# EAGLE design ovtave up SMD pcbv1 (EAGLE 9.5.2)
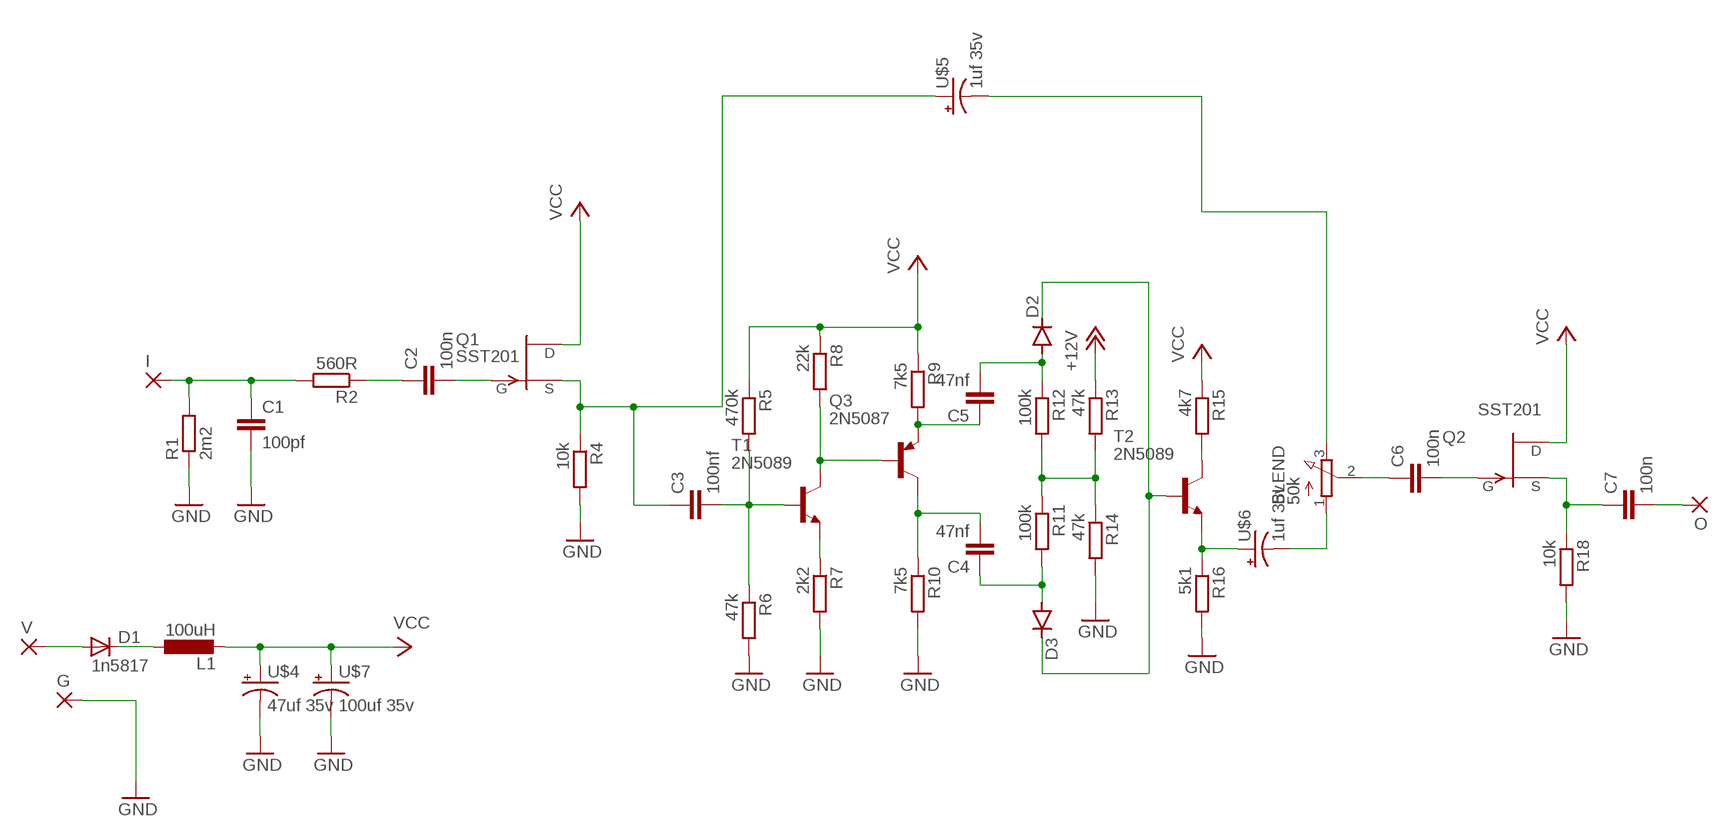
[diagram p0: schematic, sheet 1]

## Parts
BLEND  50k  HEXPOT1  [3RP/1610N]
C1  100pf  C-EUC0805K  [C0805K]
C2  100n  C-EUC0805K  [C0805K]
C3  100nf  C-EUC0805K  [C0805K]
C4  47nf  C-EUC0805K  [C0805K]
C5  47nf  C-EUC0805K  [C0805K]
C6  100n  C-EUC0805K  [C0805K]
C7  100n  C-EUC0805K  [C0805K]
D1  1n5817  SMALL_DIODEDO35-7  [DO35-7]
D2  AA112  [DO07]
D3  AA112  [DO07]
G  1,6/0,9  [1,6/0,9]
I  1,6/0,9  [1,6/0,9]
L1  100uH  L-EUL2012C  [L2012C]
O  1,6/0,9  [1,6/0,9]
Q1  SST201  [SOT23]
Q2  SST201  [SOT23]
Q3  2N5087  [TO92]
R1  2m2  R-EU_M0805  [M0805]
R2  560R  R-EU_M0805  [M0805]
R4  10k  R-EU_M0805  [M0805]
R5  470k  R-EU_M0805  [M0805]
R6  47k  R-EU_M0805  [M0805]
R7  2k2  R-EU_M0805  [M0805]
R8  22k  R-EU_M0805  [M0805]
R9  7k5  R-EU_M0805  [M0805]
R10  7k5  R-EU_M0805  [M0805]
R11  100k  R-EU_M0805  [M0805]
R12  100k  R-EU_M0805  [M0805]
R13  47k  R-EU_M0805  [M0805]
R14  47k  R-EU_M0805  [M0805]
R15  4k7  R-EU_M0805  [M0805]
R16  5k1  R-EU_M0805  [M0805]
R18  10k  R-EU_M0805  [M0805]
T1  2N5089  2N5088  [TO92]
T2  2N5089  2N5088  [TO92]
U$4  47uf 35v  CAP_SMD+THRUPAN_B  [PAN_B_SMD+THRU]
U$5  1uf 35v  CAP_SMD+THRUPAN_B  [PAN_B_SMD+THRU]
U$6  1uf 35v  CAP_SMD+THRUPAN_B  [PAN_B_SMD+THRU]
U$7  100uf 35v  CAP_SMD+THRUPAN_C  [PAN_C_SMD+THRU]
V  1,6/0,9  [1,6/0,9]

## Nets
+12V: R13.1
GND: C1.2 G.1(P) R1.1 R4.2 R6.2 R7.2 R10.2 R14.2 R16.2 R18.2 U$4.- U$4.--(-) U$7.- U$7.--(-)
N$1: C1.1 I.1(P) R1.2 R2.2
N$2: C2.2 Q1.3(G)
N$3: C2.1 R2.1
N$4: BLEND.3(E) U$5.- U$5.--(-)
N$5: D1.C L1.1
N$6: Q3.2(B) R8.2 T1.1(C)
N$7: C6.2 Q2.3(G)
N$8: BLEND.1(A) U$6.- U$6.--(-)
N$9: C3.2 R5.2 R6.1 T1.2(B)
N$10: R15.2 T2.1(C)
N$11: C4.2 Q3.1(C) R10.1
N$12: R7.1 T1.3(E)
N$13: R11.1 R12.2 R13.2 R14.1
N$14: C3.1 Q1.2(S) R4.1 U$5.+ U$5.++(+)
N$15: C4.1 D3.A R11.2
N$16: D1.A V.1(P)
N$17: D2.C D3.C T2.2(B)
N$18: C5.2 D2.A R12.1
N$19: R16.1 T2.3(E) U$6.+ U$6.++(+)
N$20: C7.1 Q2.2(S) R18.1
N$21: C7.2 O.1(P)
N$22: BLEND.2(S) C6.1
N$24: C5.1 Q3.3(E) R9.2
VCC: L1.2 Q1.1(D) Q2.1(D) R5.1 R8.1 R9.1 R15.1 U$4.+ U$4.++(+) U$7.+ U$7.++(+)

## Library data of the parts
BLEND = hexpedalpot:HEXPOT1: 16mm Potentiometer one level Source: http://www.alphapotentiometers.net/html/16mm_pot_2.html
C1-C7 = hexresistor:C-EU: CAPACITOR, European symbol; SPICEPREFIX: C
D1 = MusicThingModular:SMALL_DIODE: Small Signal Diode
D2 D3 = diode:AA112: DIODE germanium
G I O V = wirepad:1,6/0,9: THROUGH-HOLE PAD
L1 = hexresistor:L-EU: INDUCTOR, European symbol; SPICEPREFIX: L
Q1 Q2 = jfetDSG:?20*: TEMIC / Siliconix N-Channel JFET Source: JFET-J201_Siliconix_data.pdf
Q3 = transistor-pnp:2N5087: PNP Transistor
R1 R2 R4-R16 R18 = hexresistor:R-EU_: RESISTOR, European symbol; SPICEPREFIX: R
T1 T2 = transistor:2N5088: NPN TRANSISTOR
U$4-U$7 = MusicThingModular:CAP_SMD+THRU

## Net classes
0 default: width 0.254 mm

## Board
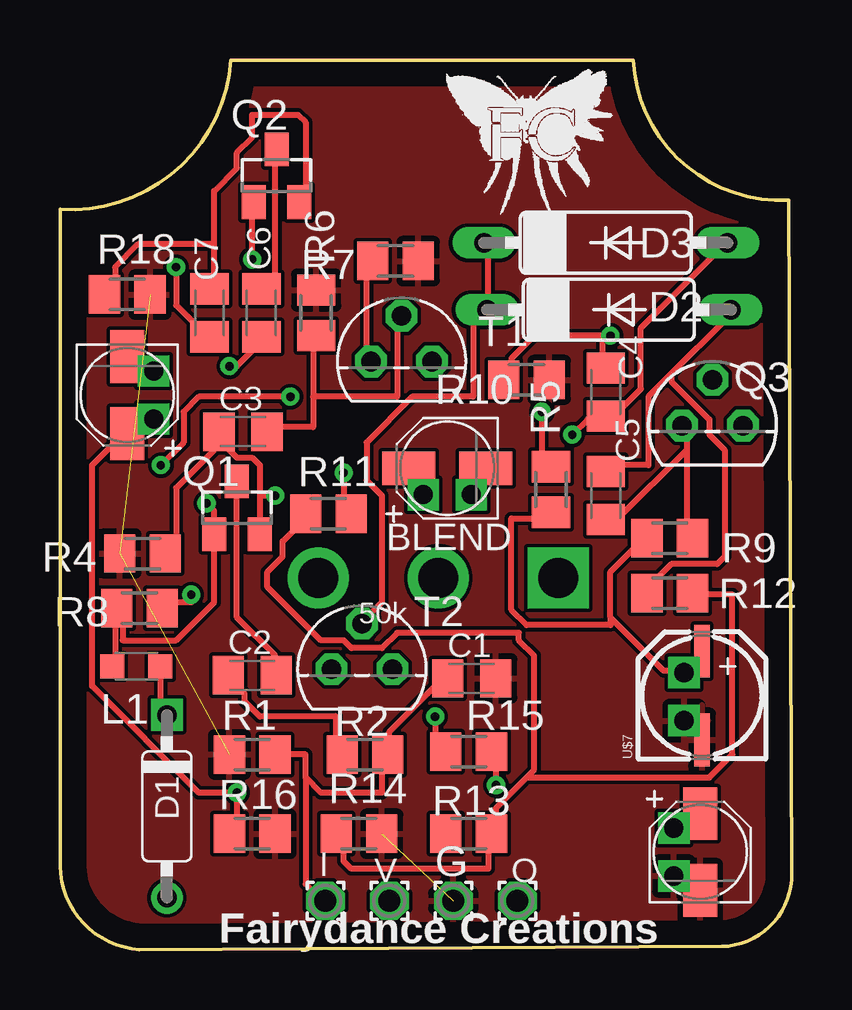
[diagram p1: board, top side]
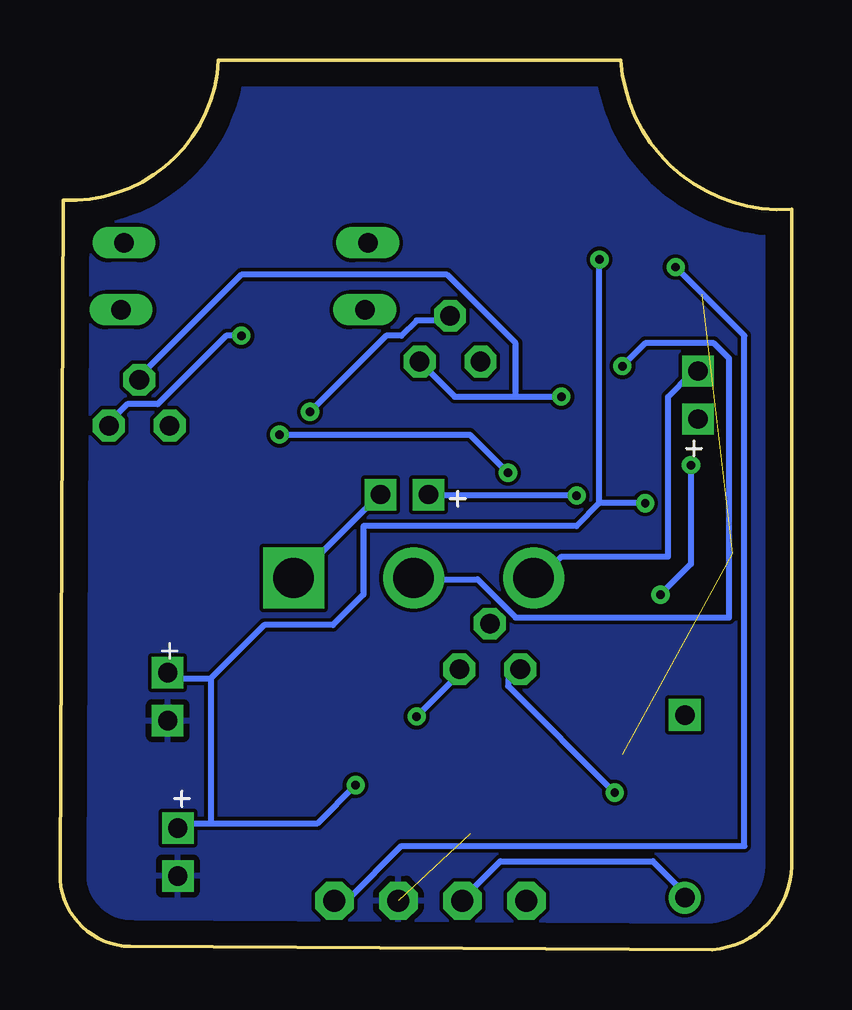
[diagram p2: board, bottom side, seen from below]

Size 30.49 x 37.08 mm. Coordinates in mm from the lower left corner, seen from the top.
Outline: 0.01,3.81 0.01,30.86 arc90 7.12,37.08 23.88,37.08 arc90 30.36,31.24 30.49,3.18 arc-90 27.57,0.13 3.31,0 arc-90 0.01,3.81
Copper layers (1*16): Top 0.035mm / dielectric 1.5mm / Bottom 0.035mm
Design rules "default": minimum track width 6mil, minimum drill 0.35mm, track to track 6mil, track to pad 6mil, pad to pad 6mil, via to via 6mil, smd to smd 6mil, copper to edge 40mil, drill to drill 6mil, minimum pad ring 10mil, minimum via ring 8mil, stop-mask expansion 4mil, vias tented up to drill 0mil, thermal gap 10mil

### Footprints (pad centres in the part's own frame; a part is rotated, then mirrored left to right if it is on the bottom)
3RP/1610N = drill 1.676 pad 2.54: 1 -5,0; 2 0,0 | drill 1.676 pad 2.54 square: 3 5,0
C0805K = smd 1.3 x 1.6: 1 -1,0; 2 1,0
DO35-7 = drill 0.813: A 3.81,0 | drill 0.813 square: C -3.81,0
DO07 = drill 0.813 long: A 5.08,0; C -5.08,0
1,6/0,9 = drill 0.914 pad 1.6 octagon: 1 0,0
L2012C = smd 1 x 1: 1 -1,0; 2 1,0
SOT23 = smd 1 x 1.4: 1 -0.95,-1.1; 2 0.95,-1.1; 3 0,1.1
TO92 = drill 0.813 octagon: 1 1.27,0; 2 0,1.905; 3 -1.27,0
M0805 = smd 1.3 x 1.6: 1 -0.95,0; 2 0.95,0
PAN_B_SMD+THRU = smd 2.2 x 1.4: + 1.6,0; - -1.6,0 | drill 0.8 pad 0.9 square: ++ 1,1.1; -- -1,1.1
PAN_C_SMD+THRU = smd 2.2 x 0.65: + 1.9,-0.2; - -1.8,-0.2 | drill 0.8 pad 0.9 square: ++ 1,0.55; -- -1,0.55

### Placement (x,y rotation side)
BLEND  15.76,15.49 0 top
C1  17.15,11.3 0 top
C2  8.01,11.43 0 top
C3  7.63,21.59 0 top
C4  22.74,23.24 90 top
C5  22.74,18.92 90 top
C6  8.39,26.54 90 top
C7  6.23,26.54 270 top
D1  4.45,5.97 270 top
D2  22.87,26.67 0 top
D3  22.74,29.46 0 top
G  16.39,2.03 0 top
I  11.06,2.03 0 top
L1  3.18,11.81 180 top
O  19.06,2.03 0 top
Q1  7.37,18.41 0 top
Q2  9.03,32.26 0 top
Q3  27.19,21.84 0 top
R1  8.01,8.13 0 top
R2  12.71,8.13 0 top
R4  3.44,16.51 180 top
R5  20.46,19.18 90 top
R6  10.68,26.54 90 top
R7  13.98,28.7 0 top
R8  3.31,14.22 0 top
R9  25.41,17.15 0 top
R10  19.44,23.75 0 top
R11  11.18,18.16 0 top
R12  25.41,14.86 0 top
R13  17.03,4.83 0 top
R14  12.45,4.83 0 top
R15  17.03,8.26 180 top
R16  8.01,4.83 0 top
R18  2.8,27.3 0 top
T1  14.23,24.51 0 top
T2  12.58,11.68 0 top
U$4  26.68,4.06 90 top
U$5  16.14,20.07 180 top
U$6  2.8,23.11 270 top
U$7  26.55,10.54 90 top
V  13.72,2.03 0 top

### Tracks (layer width: path | path; a pad name or v marks a point on that pad's centre or on a via)
GND  (3 unrouted)
  pour Bottom: -2.91,37.46 -2.91,2.16 arc90 0.14,-0.89 35.57,-0.89 35.57,37.46
  pour Top: 32.89,41.63 34.93,38.45 34.93,-0.63 -0.63,-0.63 -2.66,1.4 -2.66,37.4
N$1
  Top 0.254: R1.2 10.23,8.13 10.23,7.18 | 10.23,7.18 10.87,6.54 13.41,6.54 13.41,8.13 R2.2 13.72,8.13 13.72,9.08 15.95,11.3 C1.1 | 10.23,7.18 10.23,2.73 10.87,2.1 I.1
N$2
  Top 0.254: Q1.3 7.37,13.84 8.96,12.26 8.96,11.62 C2.2
N$3
  Top 0.254: C2.1 7.06,11.3 7.69,10.67 7.69,10.35 8.33,9.72 11.5,9.72 11.5,8.13 R2.1
N$4
  Top 0.254: U$5.- 17.53,19.88 17.22,19.56 17.22,19.24 U$5.--
  Bottom 0.254: U$5.-- 17.22,18.92 20.39,15.75 20.71,15.75 BLEND.3
N$5
  Top 0.254: L1.1 4.2,11.62 4.2,10.03 D1.C
N$6  (via drill 0.35)
  Top 0.254: v5.47,14.8 5.47,14.48 4.52,14.48 R8.2 | v4.2,20.19 5.15,21.15 5.15,22.42 5.79,23.05 v9.6,23.05
  Bottom 0.254: v5.47,14.8 4.2,16.06 v4.2,20.19 | 11.5,23.05 14.04,23.05 T1.1 | 11.5,23.05 v9.6,23.05 | 11.5,23.05 11.5,25.27 14.36,28.13 22.93,28.13 27.06,24 Q3.2
N$7
  Top 0.254: Q2.3 8.96,33.21 8.96,27.81 8.64,27.49 C6.2
N$8
  Top 0.254: U$6.- 2.93,24.64 3.88,24.64 3.88,24.32 U$6.--
  Bottom 0.254: U$6.-- 4.2,24 5.15,23.05 5.15,16.38 9.6,16.38 10.23,15.75 10.55,15.75 BLEND.1
N$9  (via drill 0.35)
  Top 0.254: 10.55,23.05 10.55,25.59 R6.1 | 10.55,23.05 10.55,21.78 8.64,21.78 C3.2 | v20.07,22.42 20.07,20.51 20.39,20.19 R5.2 | 10.55,23.05 14.04,23.05 14.04,26.23 T1.2
  Bottom 0.254: v20.07,22.42 16.9,25.59 16.26,25.59 15.63,26.23 14.36,26.23 T1.2
N$10  (via drill 0.35)
  Top 0.254: v15.63,9.72 15.63,8.76 15.95,8.45 R15.2
  Bottom 0.254: v15.63,9.72 13.72,11.62 T2.1
N$11  (via drill 0.35)
  Top 0.254: 22.61,25.59 19.76,25.59 18.8,24.64 18.8,24 R10.1 | 22.61,25.59 22.61,24.32 C4.2 | 22.61,25.59 v22.93,25.59
  Bottom 0.254: v22.93,25.59 23.57,25.59 26.42,22.73 27.69,22.73 28.33,22.1 Q3.1
N$12
  Top 0.254: R7.1 12.77,28.45 12.77,24.64 T1.3
N$13
  Top 0.254: R14.1 11.82,4.63 11.82,3.68 12.14,3.37 17.85,3.37 17.85,4.63 R13.2 18.17,4.95 18.17,5.91 19.44,7.18 | 19.44,7.18 19.76,7.49 19.76,12.26 19.12,12.89 19.12,13.21 14.04,13.21 13.41,12.57 12.14,12.57 11.82,12.89 10.87,12.89 8.64,15.11 8.64,15.75 9.28,16.38 9.28,17.02 10.23,17.97 R11.1 | 19.44,7.18 27.06,7.18 28.01,8.13 28.01,14.8 26.42,14.8 R12.2
N$14  (via drill 0.35)
  Top 0.254: U$5.+ 14.68,19.88 14.99,19.56 14.99,19.24 U$5.++ | 8.33,18.92 8.33,20.19 8.01,20.51 7.37,20.51 6.74,21.15 6.74,21.46 C3.1 6.42,21.46 6.42,20.83 4.83,19.24 4.83,17.02 4.52,16.7 R4.1 | 8.33,18.92 8.33,17.34 Q1.2 | 8.33,18.92 v8.96,18.92
  Bottom 0.254: v8.96,18.92 14.99,18.92 U$5.++
N$15  (via drill 0.35)
  Top 0.254: v11.82,19.88 11.82,18.29 R11.2 | v21.34,21.46 21.98,22.1 22.61,22.1 C4.1 22.93,22.1 24.2,23.37 24.2,25.91 27.69,29.4 D3.A
  Bottom 0.254: v11.82,19.88 13.41,21.46 v21.34,21.46
N$16
  Bottom 0.254: D1.A 4.52,2.41 5.79,3.68 12.14,3.68 13.72,2.1 V.1
N$17
  Top 0.254: T2.2 12.77,13.84 13.41,14.48 13.41,18.92 12.77,19.56 12.77,21.15 14.68,23.05 17.22,23.05 17.22,26.23 17.53,26.54 D2.C 17.85,26.86 17.85,29.4 D3.C
N$18
  Top 0.254: 25.47,24 27.69,26.23 27.69,26.54 D2.A | 25.47,24 24.52,23.05 24.52,20.19 22.93,20.19 C5.2 | 25.47,24 25.47,23.68 27.06,22.1 27.06,21.46 27.69,20.83 27.69,16.38 27.38,16.06 25.47,16.06 24.52,15.11 R12.1
N$19  (via drill 0.35)
  Top 0.254: U$6.++ 3.88,22.1 3.88,21.78 2.93,21.78 U$6.+ 2.61,21.46 1.34,20.19 1.34,10.99 5.79,6.54 v7.37,6.54 7.37,4.95 R16.1
  Bottom 0.254: v7.37,6.54 11.82,10.99 11.82,11.62 11.5,11.62 T2.3
N$20
  Top 0.254: 6.42,29.4 6.42,27.81 C7.1 | 6.42,29.4 6.42,31.62 7.37,32.57 7.37,33.21 8.01,33.85 8.01,34.8 9.91,34.8 10.23,34.48 10.23,31.31 Q2.2 | 6.42,29.4 3.25,29.4 2.29,28.45 2.29,27.81 1.98,27.49 R18.1
N$21  (via drill 0.35)
  Top 0.254: v4.83,28.45 4.83,26.86 6.1,25.59 C7.2
  Bottom 0.254: v4.83,28.45 1.98,25.59 1.98,4.32 16.26,4.32 18.49,2.1 18.8,2.1 O.1
N$22  (via drill 0.35)
  Top 0.254: v7.06,24.32 7.37,24.32 8.33,25.27 C6.1
  Bottom 0.254: v7.06,24.32 6.1,25.27 3.25,25.27 2.61,24.64 2.61,13.84 11.5,13.84 13.09,15.43 15.63,15.43 BLEND.2
N$24
  Top 0.254: 26.11,20.83 26.11,21.78 Q3.3 | 26.11,20.83 26.11,17.34 R9.2 | 26.11,20.83 23.25,17.97 22.93,17.97 C5.1
VCC  (via drill 0.35)
  Top 0.254: v18.17,6.86 18.17,8.13 R15.1 | U$4.+ 26.42,5.59 25.79,4.95 U$4.++ | 22.93,13.84 22.93,15.75 24.2,17.02 R9.1 | 22.93,13.84 25.15,11.62 25.79,11.62 U$7.++ 26.11,11.62 26.74,12.26 U$7.+ | 22.93,13.84 22.93,13.52 19.44,13.52 18.8,14.16 18.8,17.97 20.39,17.97 R5.1 | L1.2 2.29,11.94 2.29,14.16 R8.1 2.61,14.16 2.61,12.89 4.83,12.89 6.42,14.48 6.42,17.02 Q1.1 6.42,17.34 6.42,18.29 v6.1,18.61 | v8.01,28.77 8.01,30.99 Q2.1
  Bottom 0.254: v18.17,6.86 19.76,5.27 24.2,5.27 | 24.2,5.27 25.47,5.27 U$4.++ | 24.2,11.3 24.2,5.27 | 24.2,11.3 25.79,11.3 U$7.++ | 8.01,18.61 v8.01,28.77 | v6.1,18.61 8.01,18.61 | 24.2,11.3 21.98,13.52 19.12,13.52 17.85,14.8 17.85,17.65 8.96,17.65 8.01,18.61

### Text on the board
tNames: Fairydance Creations